# Altium schematic sheet Power_LED_1.SchDoc
size A4
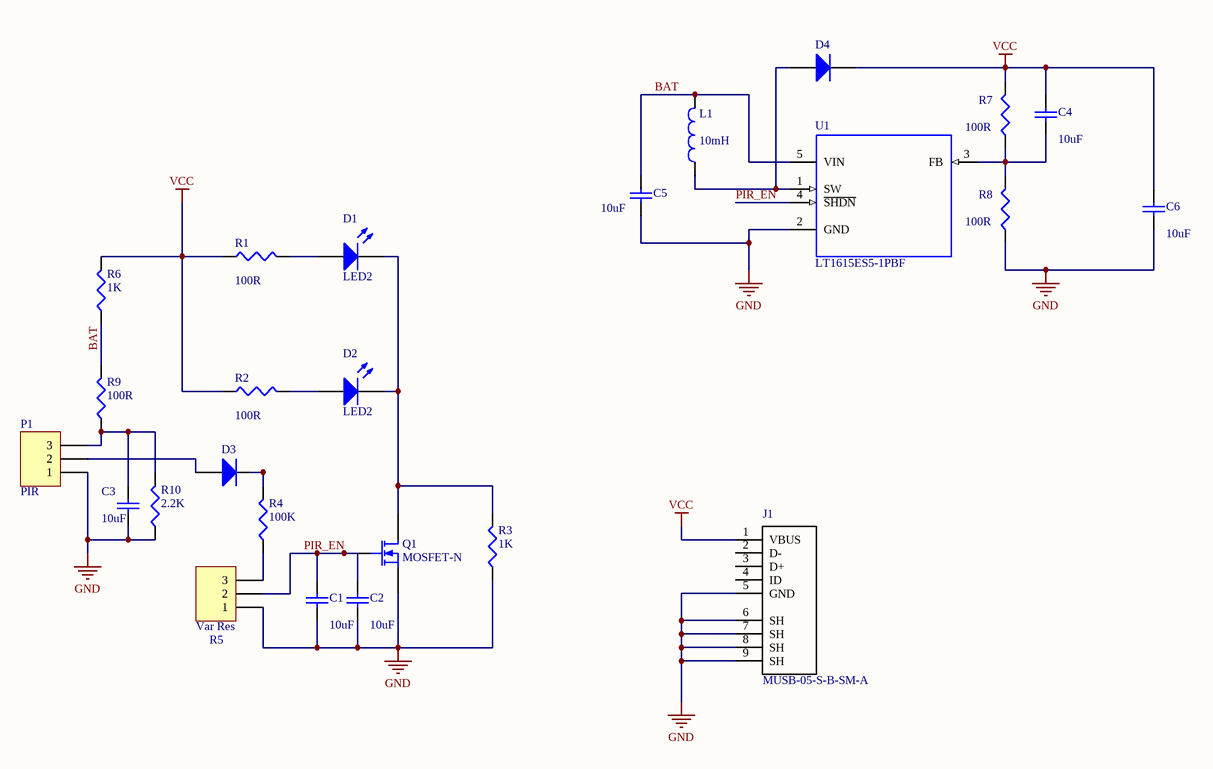
[diagram p0: Power_LED_1.SchDoc]

## Parts
C1  value 10uF  [C1206]
C2  value 10uF  [C0805]
C3  value 10uF  [C1206]
C4  value 10uF  [C0805]
C5  value 10uF  [C0805]
C6  value 10uF  [C0805]
D1  LED2  [3.2X1.6X1.1]
D2  LED2  [3.2X1.6X1.1]
D3  (no value)  [6-0805_L]
D4  (no value)  [6-0805_L]
J1  MUSB-05-S-B-SM-A  [*SAMTEC_MUSB-05-S-B-SM-A]
L1  value 10mH  [6-0805_L]
P1  PIR  [HDR1X3]
Q1  MOSFET-N  [TO-220-AB]
R1  value 100R  [6-0805_L]
R2  value 100R  [6-0805_L]
R3  value 1K  [6-0805_L]
R4  value 100K  [6-0805_L]
R5  Var Res  [HDR1X3]
R6  value 1K  [6-0805_L]
R7  value 100R  [6-0805_L]
R8  value 100R  [6-0805_L]
R9  value 100R  [6-0805_L]
R10  value 2.2K  [6-0805_L]
U1  LT1615ES5-1PBF  [SOT95P280X145-5N]

## Nets
GND: C1.1 C2.1 C3.1 C5.1 C6.1 J1.5(GND) J1.6(SH) J1.7(SH) J1.8(SH) J1.9(SH) P1.1 Q1.3(S) R3.1 R5.1 R8.1 R10.1 U1.2(GND)
VCC: C4.2 C6.2 D4.2(K) J1.1(VBUS) R1.1 R2.1 R6.2 R7.2
BAT: C5.2 L1.2 R6.1 R9.2 U1.5(VIN)
PIR_EN: C1.2 C2.2 Q1.2(G) R5.2 U1.4(~{SHDN})
NetC3_2: C3.2 P1.3 R9.1 R10.2
NetC4_1: C4.1 R7.1 R8.2 U1.3(FB)
NetD1_1: D1.1(A) R1.2
NetD1_2: D1.2(K) D2.2(K) Q1.1(D) R3.2
NetD2_1: D2.1(A) R2.2
NetD3_1: D3.1(A) P1.2
NetD3_2: D3.2(K) R4.2
NetD4_1: D4.1(A) L1.1 U1.1(SW)
NetR4_1: R4.1 R5.3

Not connected (* = marked no-connect by the designer): J1 2(D-) 3(D+) 4(ID)

## Library data of the parts
C1-C6 = Cap Semi: Capacitor (Semiconductor SIM Model); Published: 8-Jun-2000; LatestRevisionDate: 29-May-2009; LatestRevisionNote: IPC-7351 Footprint Added.; PackageReference: C1206; Publisher: Altium Limited; PackageDescription: Chip Capacitor
D1 D2 = LED2: Typical RED, GREEN, YELLOW, AMBER GaAs LED; Published: 8-Jun-2000; LatestRevisionDate: 17-Jul-2002; LatestRevisionNote: Re-released for DXP Platform.; PackageVersion: Feb-2002; PackageReference: 3.2X1.6X1.1; Publisher: Altium Limited; PackageDescription: SM LED; 2 Flat Leads
D3 D4 = Diode 1N4001: 1 Amp General Purpose Rectifier; Published: 8-Jun-2000; LatestRevisionDate: 17-Jul-2002; LatestRevisionNote: Re-released for DXP Platform.; DatasheetVersion: 1998; PackageVersion: Aug-1999; PackageReference: DO-41; Publisher: Altium Limited; PackageDescription: Diode, Axial; Body 5.2 x 2.7 mm (LxDia. max), Lead Dia. 0.86 mm (max); Code_JEDEC: DO-204-AL; ComponentLink1Description: Manufacturer Link; ComponentLink1URL: http://www.fairchildsemi.com/; ComponentLink2Description: Datasheet; ComponentLink2URL: http://www.fairchildsemi.com/ds/1N%2F1N4001.pdf
J1 = MUSB-05-S-B-SM-A: Usb Interface 5-Contacts Surfacemount For Mini Usb Gold Mating Tin On Tails; MF: Samtec; Package: None; MP: MUSB-05-S-B-SM-A; Digi-Key_Purchase_URL: https://www.digikey.com/product-detail/en/samtec-inc/MUSB-05-S-B-SM-A/SAM8841-ND/2664354?utm_source=snapeda&utm_medium=aggregator&utm_campaign=symbol; Digi-Key_Part_Number: SAM8841-ND; SnapEDA_Link: https://www.snapeda.com/parts/MUSB-05-S-B-SM-A/Samtec%20Inc./view-part/?ref=snap; Value: *
L1 = Inductor: Code_IEC: 1005; Published: 8-Jun-2000; LatestRevisionDate: 29-May-2009; LatestRevisionNote: IPC-7351 Footprint Added.; PackageReference: 0402-A; Publisher: Altium Limited; PackageDescription: Chip Inductor; Code_JEITA: 0402
P1 R5 = Header 3: Header, 3-Pin; LatestRevisionDate: 17-Jul-2002; LatestRevisionNote: Re-released for DXP Platform.; Publisher: Altium Limited
Q1 = MOSFET-N: N-Channel MOSFET; Published: 8-Jun-2000; LatestRevisionDate: 17-Jul-2002; LatestRevisionNote: Re-released for DXP Platform.; PackageVersion: 1995/1996; PackageReference: E3; Publisher: Altium Limited; PackageDescription: TO, Flat Index; 3 In-Line, Axial Leads; Body Dia. 4.6mm; Lead Dia. 0.5 mm (max)
R1-R4 R6-R10 = Res3: Resistor; Published: 8-Jun-2000; LatestRevisionDate: 29-May-2009; LatestRevisionNote: IPC-7351 Footprint Added.; PackageReference: J1-0603; Publisher: Altium Limited; PackageDescription: Chip Resistor
U1 = LT1615ES5-1PBF: Micropower Step-Up DC/DC Converters; MF: {'manufacturer': u'Analog Devices, Inc.'}; Price: None; Availability: Unavailable; Value: *; MP: LT1615ES5-1PBF; Package: None